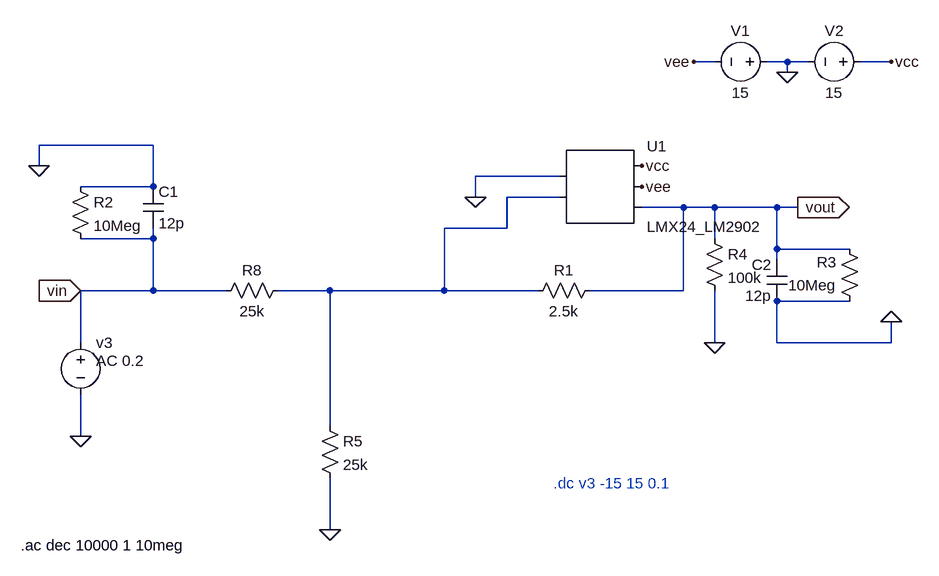
[diagram p0: schematic ej1_circ1_caso3.asc]
ej1_circ1_caso3.asc, the LTspice schematic file:
Version 4
SHEET 1 880 696
WIRE 432 -64 400 -64
WIRE 544 -64 512 -64
WIRE 576 -64 544 -64
WIRE 704 -64 656 -64
WIRE 544 -48 544 -64
WIRE -432 64 -608 64
WIRE -608 96 -608 64
WIRE 192 112 64 112
WIRE -432 128 -432 64
WIRE -432 128 -544 128
WIRE 64 144 64 112
WIRE 192 144 112 144
WIRE 384 160 320 160
WIRE 432 160 384 160
WIRE 528 160 432 160
WIRE 560 160 528 160
WIRE 112 192 112 144
WIRE 112 192 16 192
WIRE -432 208 -432 192
WIRE -432 208 -544 208
WIRE 432 208 432 160
WIRE 528 224 528 160
WIRE 640 224 528 224
WIRE 528 240 528 224
WIRE -432 288 -432 208
WIRE -432 288 -544 288
WIRE -320 288 -432 288
WIRE -160 288 -240 288
WIRE 16 288 16 192
WIRE 16 288 -160 288
WIRE 160 288 16 288
WIRE 384 288 384 160
WIRE 384 288 240 288
WIRE 640 304 528 304
WIRE -544 368 -544 288
WIRE 432 368 432 288
WIRE 528 368 528 304
WIRE 704 368 704 336
WIRE 704 368 528 368
WIRE -160 496 -160 288
WIRE -544 512 -544 448
WIRE -160 656 -160 576
FLAG 64 144 0
FLAG 432 368 0
FLAG 560 160 vout
IOPIN 560 160 Out
FLAG 544 -48 0
FLAG 320 128 vee
FLAG 400 -64 vee
FLAG 704 -64 vcc
FLAG 320 96 vcc
FLAG -160 656 0
FLAG -544 288 vin
IOPIN -544 288 In
FLAG -544 512 0
FLAG -608 96 0
FLAG 704 336 0
SYMBOL AutoGenerated\\LMX24_LM2902 256 128 R0
SYMATTR InstName U1
SYMBOL res 416 192 R0
SYMATTR InstName R4
SYMATTR Value 100k
SYMBOL voltage 528 -64 R90
WINDOW 0 -32 56 VBottom 2
WINDOW 3 32 56 VTop 2
WINDOW 123 0 0 Left 0
WINDOW 39 0 0 Left 0
SYMATTR InstName V1
SYMATTR Value 15
SYMBOL voltage 672 -64 R90
WINDOW 0 -32 56 VBottom 2
WINDOW 3 32 56 VTop 2
WINDOW 123 0 0 Left 0
WINDOW 39 0 0 Left 0
SYMATTR InstName V2
SYMATTR Value 15
SYMBOL res -176 480 R0
SYMATTR InstName R5
SYMATTR Value 25k
SYMBOL voltage -544 352 R0
WINDOW 123 24 44 Left 2
WINDOW 39 0 0 Left 0
SYMATTR Value2 AC 0.2
SYMATTR InstName v3
SYMATTR Value ""
SYMBOL res -336 304 R270
WINDOW 0 32 56 VTop 2
WINDOW 3 0 56 VBottom 2
SYMATTR InstName R8
SYMATTR Value 25k
SYMBOL res 256 272 R90
WINDOW 0 0 56 VBottom 2
WINDOW 3 32 56 VTop 2
SYMATTR InstName R1
SYMATTR Value 2.5k
SYMBOL res -560 112 R0
SYMATTR InstName R2
SYMATTR Value 10Meg
SYMBOL cap -448 128 R0
SYMATTR InstName C1
SYMATTR Value 12p
SYMBOL res 656 320 R180
WINDOW 0 36 76 Left 2
WINDOW 3 36 40 Left 2
SYMATTR InstName R3
SYMATTR Value 10Meg
SYMBOL cap 544 304 R180
WINDOW 0 24 56 Left 2
WINDOW 3 24 8 Left 2
SYMATTR InstName C2
SYMATTR Value 12p
TEXT 184 584 Left 2 ;.dc v3 -15 15 0.1
TEXT -636 680 Left 2 !.ac dec 10000 1 10meg

The netlist it stands for:
* ej1_circ1_caso3.asc
* U1: LMX24_LM2902 (symbol AutoGenerated\LMX24_LM2902 not available, pins judged from their places): pin1=0 pin2=N001 pin3=vcc pin4=vee pin5=vout
R4 vout 0 100k
V1 0 vee 15
V2 vcc 0 15
R5 N001 0 25k
v3 vin 0 AC 0.2
R8 vin N001 25k
R1 vout N001 2.5k
R2 0 vin 10Meg
C1 0 vin 12p
R3 0 vout 10Meg
C2 0 vout 12p
* .dc v3 -15 15 0.1
.ac dec 10000 1 10meg
.backanno
.end